# Altium schematic sheet LPCXpresso55SXX_MCU.SchDoc
size A3; CheckedBy: José Ogando; Engineer: Eduardo Teofilo; Revision: A2; SheetNumber: 3; SheetTotal: 8
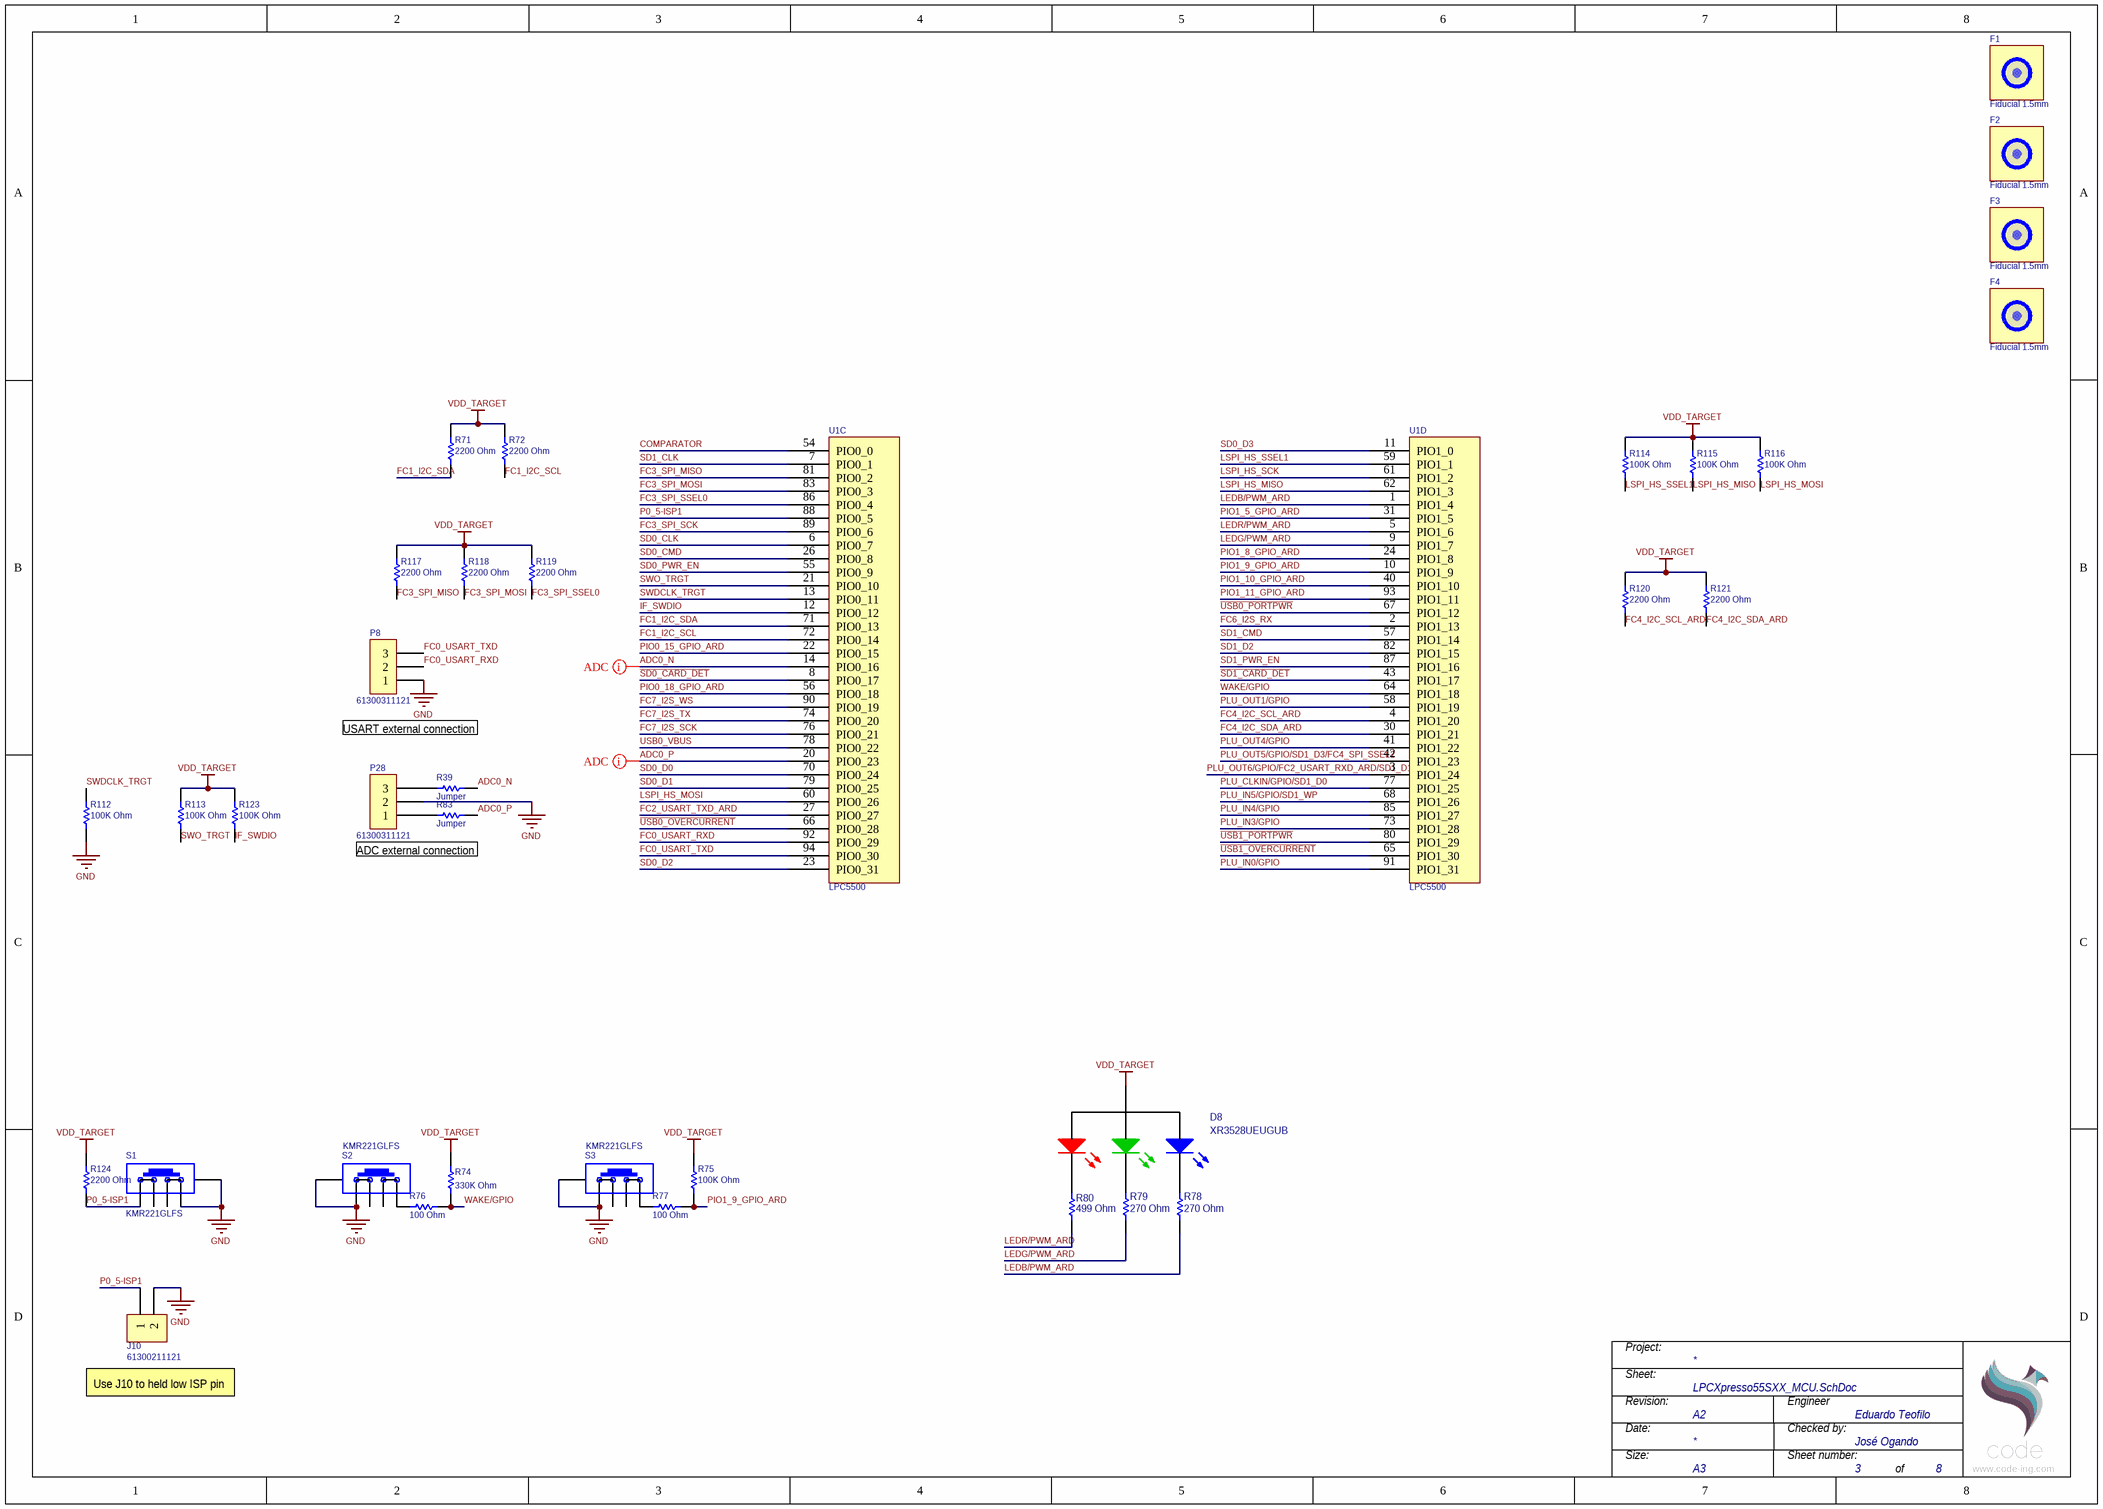
[diagram p0: LPCXpresso55SXX_MCU.SchDoc]

## Parts
D8  XR3528UEUGUB  [XR3528UEUGUB]
F1  Fiducial 1.5mm  [Fiducial 1.5mm]  (no BOM)
F2  Fiducial 1.5mm  [Fiducial 1.5mm]  (no BOM)
F3  Fiducial 1.5mm  [Fiducial 1.5mm]  (no BOM)
F4  Fiducial 1.5mm  [Fiducial 1.5mm]  (no BOM)
J10  61300211121  [61300211121]
P8  61300311121  [61300311121]
P28  61300311121  [61300311121]
R39  Jumper  [RESC0402(1005)_L]
R71  value 2200 Ohm  [RESC0402(1005)_L]  (hidden comment: 2K2 1% 0402(1005))
R72  value 2200 Ohm  [RESC0402(1005)_L]  (hidden comment: 2K2 1% 0402(1005))
R74  value 330K Ohm  [RESC0402(1005)_N]  (hidden comment: 330K 1% 0402(1005))
R75  value 100K Ohm  [RESC1005X40X25LL05T05]  (hidden comment: ERJ-2RKF1003X)
R76  value 100 Ohm  [RESC0402(1005)_L]  (hidden comment: 100R 5% 0402(1005))
R77  value 100 Ohm  [RESC0402(1005)_L]  (hidden comment: 100R 5% 0402(1005))
R78  value 270 Ohm  [RESC0402(1005)_L]  (hidden comment: 270R 1% 0402(1005))
R79  value 270 Ohm  [RESC0402(1005)_L]  (hidden comment: 270R 1% 0402(1005))
R80  value 499 Ohm  [RESC0402(1005)_L]  (hidden comment: 499R 1% 0402(1005))
R83  Jumper  [RESC0402(1005)_L]
R112  value 100K Ohm  [RESC1005X40X25LL05T05]  (hidden comment: ERJ-2RKF1003X)
R113  value 100K Ohm  [RESC1005X40X25LL05T05]  (hidden comment: ERJ-2RKF1003X)
R114  value 100K Ohm  [RESC1005X40X25LL05T05]  (hidden comment: ERJ-2RKF1003X)
R115  value 100K Ohm  [RESC1005X40X25LL05T05]  (hidden comment: ERJ-2RKF1003X)
R116  value 100K Ohm  [RESC1005X40X25LL05T05]  (hidden comment: ERJ-2RKF1003X)
R117  value 2200 Ohm  [RESC0402(1005)_L]  (hidden comment: 2K2 1% 0402(1005))
R118  value 2200 Ohm  [RESC0402(1005)_L]  (hidden comment: 2K2 1% 0402(1005))
R119  value 2200 Ohm  [RESC0402(1005)_L]  (hidden comment: 2K2 1% 0402(1005))
R120  value 2200 Ohm  [RESC0402(1005)_L]  (hidden comment: 2K2 1% 0402(1005))
R121  value 2200 Ohm  [RESC0402(1005)_L]  (hidden comment: 2K2 1% 0402(1005))
R123  value 100K Ohm  [RESC1005X40X25LL05T05]  (hidden comment: ERJ-2RKF1003X)
R124  value 2200 Ohm  [RESC0402(1005)_L]  (hidden comment: 2K2 1% 0402(1005))
S1  KMR221GLFS  [KMR221GLFS]
S2  KMR221GLFS  [KMR221GLFS]
S3  KMR221GLFS  [KMR221GLFS]
U1  LPC5500  [LQFP EP 100]  (parts C,D of 4)

## Nets
GND: J10.2 P8.1 P28.2 R112.1 S1.2 S1.5 S2.2 S2.5 S3.2 S3.5
VDD_TARGET: D8.2 R71.2 R72.2 R74.2 R75.2 R113.2 R114.2 R115.2 R116.2 R117.2 R118.2 R119.2 R120.2 R121.2 R123.2 R124.1
ADC0_N: R39.1 U1.14(PIO0_16)
ADC0_P: R83.1 U1.20(PIO0_23)
COMPARATOR: U1.54(PIO0_0)
FC0_USART_RXD: P8.2 U1.92(PIO0_29)
FC0_USART_TXD: P8.3 U1.94(PIO0_30)
FC1_I2C_SCL: R72.1 U1.72(PIO0_14)
FC1_I2C_SDA: R71.1 U1.71(PIO0_13)
FC2_USART_TXD_ARD: U1.27(PIO0_27)
FC3_SPI_MISO: R117.1 U1.81(PIO0_2)
FC3_SPI_MOSI: R118.1 U1.83(PIO0_3)
FC3_SPI_SCK: U1.89(PIO0_6)
FC3_SPI_SSEL0: R119.1 U1.86(PIO0_4)
FC4_I2C_SCL_ARD: R120.1 U1.4(PIO1_20)
FC4_I2C_SDA_ARD: R121.1 U1.30(PIO1_21)
FC6_I2S_RX: U1.2(PIO1_13)
FC7_I2S_SCK: U1.76(PIO0_21)
FC7_I2S_TX: U1.74(PIO0_20)
FC7_I2S_WS: U1.90(PIO0_19)
IF_SWDIO: R123.1 U1.12(PIO0_12)
LEDB/PWM_ARD: R78.1 U1.1(PIO1_4)
LEDG/PWM_ARD: R79.1 U1.9(PIO1_7)
LEDR/PWM_ARD: R80.1 U1.5(PIO1_6)
LSPI_HS_MISO: R115.1 U1.62(PIO1_3)
LSPI_HS_MOSI: R116.1 U1.60(PIO0_26)
LSPI_HS_SCK: U1.61(PIO1_2)
LSPI_HS_SSEL1: R114.1 U1.59(PIO1_1)
P0_5-ISP1: J10.1 R124.2 S1.1 U1.88(PIO0_5)
PIO0_15_GPIO_ARD: U1.22(PIO0_15)
PIO0_18_GPIO_ARD: U1.56(PIO0_18)
PIO1_5_GPIO_ARD: U1.31(PIO1_5)
PIO1_8_GPIO_ARD: U1.24(PIO1_8)
PIO1_9_GPIO_ARD: R75.1 R77.2 U1.10(PIO1_9)
PIO1_10_GPIO_ARD: U1.40(PIO1_10)
PIO1_11_GPIO_ARD: U1.93(PIO1_11)
PLU_CLKIN/GPIO/SD1_D0: U1.77(PIO1_25)
PLU_IN0/GPIO: U1.91(PIO1_31)
PLU_IN3/GPIO: U1.73(PIO1_28)
PLU_IN4/GPIO: U1.85(PIO1_27)
PLU_IN5/GPIO/SD1_WP: U1.68(PIO1_26)
PLU_OUT1/GPIO: U1.58(PIO1_19)
PLU_OUT4/GPIO: U1.41(PIO1_22)
PLU_OUT5/GPIO/SD1_D3/FC4_SPI_SSEL2: U1.42(PIO1_23)
PLU_OUT6/GPIO/FC2_USART_RXD_ARD/SD1_D1: U1.3(PIO1_24)
~{SD0_CARD_DET}: U1.8(PIO0_17)
~{SD1_CARD_DET}: U1.43(PIO1_17)
SD0_CLK: U1.6(PIO0_7)
SD0_CMD: U1.26(PIO0_8)
SD0_D0: U1.70(PIO0_24)
SD0_D1: U1.79(PIO0_25)
SD0_D2: U1.23(PIO0_31)
SD0_D3: U1.11(PIO1_0)
SD0_PWR_EN: U1.55(PIO0_9)
SD1_CLK: U1.7(PIO0_1)
SD1_CMD: U1.57(PIO1_14)
SD1_D2: U1.82(PIO1_15)
SD1_PWR_EN: U1.87(PIO1_16)
SWDCLK_TRGT: R112.2 U1.13(PIO0_11)
SWO_TRGT: R113.1 U1.21(PIO0_10)
~{USB0_OVERCURRENT}: U1.66(PIO0_28)
~{USB0_PORTPWR}: U1.67(PIO1_12)
~{USB1_OVERCURRENT}: U1.65(PIO1_30)
~{USB1_PORTPWR}: U1.80(PIO1_29)
USB0_VBUS: U1.78(PIO0_22)
WAKE/GPIO: R74.1 R76.2 U1.64(PIO1_18)
NetD8_1: D8.1 R78.2
NetD8_3: D8.3 R80.2
NetD8_4: D8.4 R79.2
NetP28_1: P28.1 R83.2
NetP28_3: P28.3 R39.2
NetR76_1: R76.1 S2.1
NetR77_1: R77.1 S3.1

Not connected (* = marked no-connect by the designer): F1 1; F2 1; F3 1; F4 1; S1 3 4; S2 3 4; S3 3 4

## Layout directives
net class ADC: ADC0_N, ADC0_P

## Notes on the sheet
- USART external connection
- ADC external connection
- Use J10 to held low ISP pin
- Project:
- Sheet:
- Revision:
- Date:
- Size:
- Sheet number:
- Engineer
- Checked by:
- A3
- of
- www.code-ing.com

## Library data of the parts
D8 = XR3528UEUGUB: LED RGB SMD DIFF 4-PLCC; DigiKey: *; Manufacturer part #: XR3528UEUGUB; Creation date: 04-06-2019; Created by: cmartinez; Modified by: *; Indications: *; Value: *
J10 = 61300211121: HEADER 2POS SNGL T/H 2.54MM; Manufacturer: Wurth Electronics Inc; Manufacturer part #: 61300211121; Modified by: *; Value: *; Created by: gmoreno; Creation date: 28-Jul-2012
P8 = 61300311121: HEADER 3POS SNGL T/H 2.54MM; Manufacturer: Wurth Electronics Inc; Manufacturer part #: 61300311121; DigiKey: *; Indications: *; Modified by: *; Value: *; Created by: gmoreno; Creation date: 28-Jul-2012
P28 = 61300311121: HEADER 3POS SNGL T/H 2.54MM; Manufacturer: Wurth Electronics Inc; Indications: DNI; Manufacturer part #: 61300311121; DigiKey: *; Modified by: *; Value: *; Created by: gmoreno; Creation date: 28-Jul-2012
R39 R83 = CMP-1011-00001-1: Jumper 0402 (1005 Metric); Tolerance: None; Case-Metric: 1005; Case-EIA: 0402; Value: 0 Ohm; Power: None; Technology: SMT
R71 R72 R117-R121 R124 = CMP-1011-00546-1: 2K2 0.063W 1% 0402 (1005 Metric)  SMD; Case-Metric: 1005; Case-EIA: 0402; Power: 0.063 W; Tolerance: 1 %; Technology: SMT
R74 = CMP-1011-00793-1: 330K 0.063W 1% 0402 (1005 Metric)  SMD; Case-Metric: 1005; Case-EIA: 0402; Technology: SMT; Power: 0.063 W; Tolerance: 1 %
R75 R112 R113 R115 R116 R123 = CMP-2002-00608-3: Chip Resistor, 100 KOhm, +/- 1%, 100 mW, -55 to 155 degC, 0402 (1005 Metric), RoHS, Tape and Reel; Manufacturer: Basic Passives; Power Rating: 100 mW; Voltage Rating: 50 V; Case\/Package: 0402; Case Code (Imperial): 0402; RoHSCompliant: true; Min Operating Temperature: -55 degC; Mount: Surface Mount; Packaging: Tape and Reel; PackageDescription: 2-Pin Surface Mount Device, Body 1 x 0.5 mm; Tolerance: 1%; REACH SVHC: Yes; ComponentLink1URL: http://www.panasonic.com/; ComponentLink1Description: Manufacturer URL; Package Quantity: 10000; Mounting Technology: Surface Mount; DatasheetVersion: 04/2015; PartNumber: ERJ-2RKF1003X; Height: 0.35 mm; Pins: 2; Length: 1 mm; Max Operating Temperature: 155 degC; ComponentLink2Description: Datasheet; ComponentLink2URL: http://industrial.panasonic.com/cdbs/www-data/pdf/RDA0000/AOA0000C86.pdf; PackageReference: 0402; Radiation Hardening: No; Width: 0.5 mm; Case Code (Metric): 1005
R76 R77 = CMP-1011-00050-1: 100R 0.063W 5% 0402 (1005 Metric)  SMD; Case-Metric: 1005; Case-EIA: 0402; Power: 0.063 W; Technology: SMT; Tolerance: 5 %
R78 R79 = CMP-1011-00444-1: 270R 0.063W 1% 0402 (1005 Metric)  SMD; Case-EIA: 0402; Case-Metric: 1005; Technology: SMT; Tolerance: 1 %; Power: 0.063 W
R80 = CMP-1011-00476-1: 499R 0.063W 1% 0402 (1005 Metric)  SMD; Case-EIA: 0402; Case-Metric: 1005; Technology: SMT; Tolerance: 1 %; Power: 0.063 W
R114 = CMP-2002-00608-3: Chip Resistor, 100 KOhm, +/- 1%, 100 mW, -55 to 155 degC, 0402 (1005 Metric), RoHS, Tape and Reel; Manufacturer: Basic Passives; Power Rating: 100 mW; Voltage Rating: 50 V; Case\/Package: 0402; Indications: DNI; Case Code (Imperial): 0402; RoHSCompliant: true; Min Operating Temperature: -55 degC; Mount: Surface Mount; Packaging: Tape and Reel; PackageDescription: 2-Pin Surface Mount Device, Body 1 x 0.5 mm; Tolerance: 1%; REACH SVHC: Yes; ComponentLink1URL: http://www.panasonic.com/; ComponentLink1Description: Manufacturer URL; Package Quantity: 10000; Mounting Technology: Surface Mount; DatasheetVersion: 04/2015; PartNumber: ERJ-2RKF1003X; Height: 0.35 mm; Pins: 2; Length: 1 mm; Max Operating Temperature: 155 degC; ComponentLink2Description: Datasheet; ComponentLink2URL: http://industrial.panasonic.com/cdbs/www-data/pdf/RDA0000/AOA0000C86.pdf; PackageReference: 0402; Radiation Hardening: No; Width: 0.5 mm; Case Code (Metric): 1005
S1-S3 = KMR221GLFS: SWITCH TACTILE SPST-NO 0.05A 32V; Manufacturer: C&K; Created by: eteofilo; Creation Date: 06-Jul-2017; Indications: *; Manufacturer part #: KMR221GLFS; Modified by: *; Value: *
U1 = LPC5500: 32-bit ARM Cortex-M33, 312 KB SRAM, LPC55XX Series; Manufacturer: NXP; Manufacturer Part #: LPC5500; Created by: eteofilo; Creation Date: 05-Apr-2018; Modified by: *; Indications: *; Value: *
F1-F4 = Fiducial 1.5mm: Manufacturer: *; Manufacturer Part #: *; Created by: lsanchez; Creation Date: 05-Sep-2017; Value: *; Indications: *; Modified by: *